# EAGLE design wordclock (EAGLE 5.10)
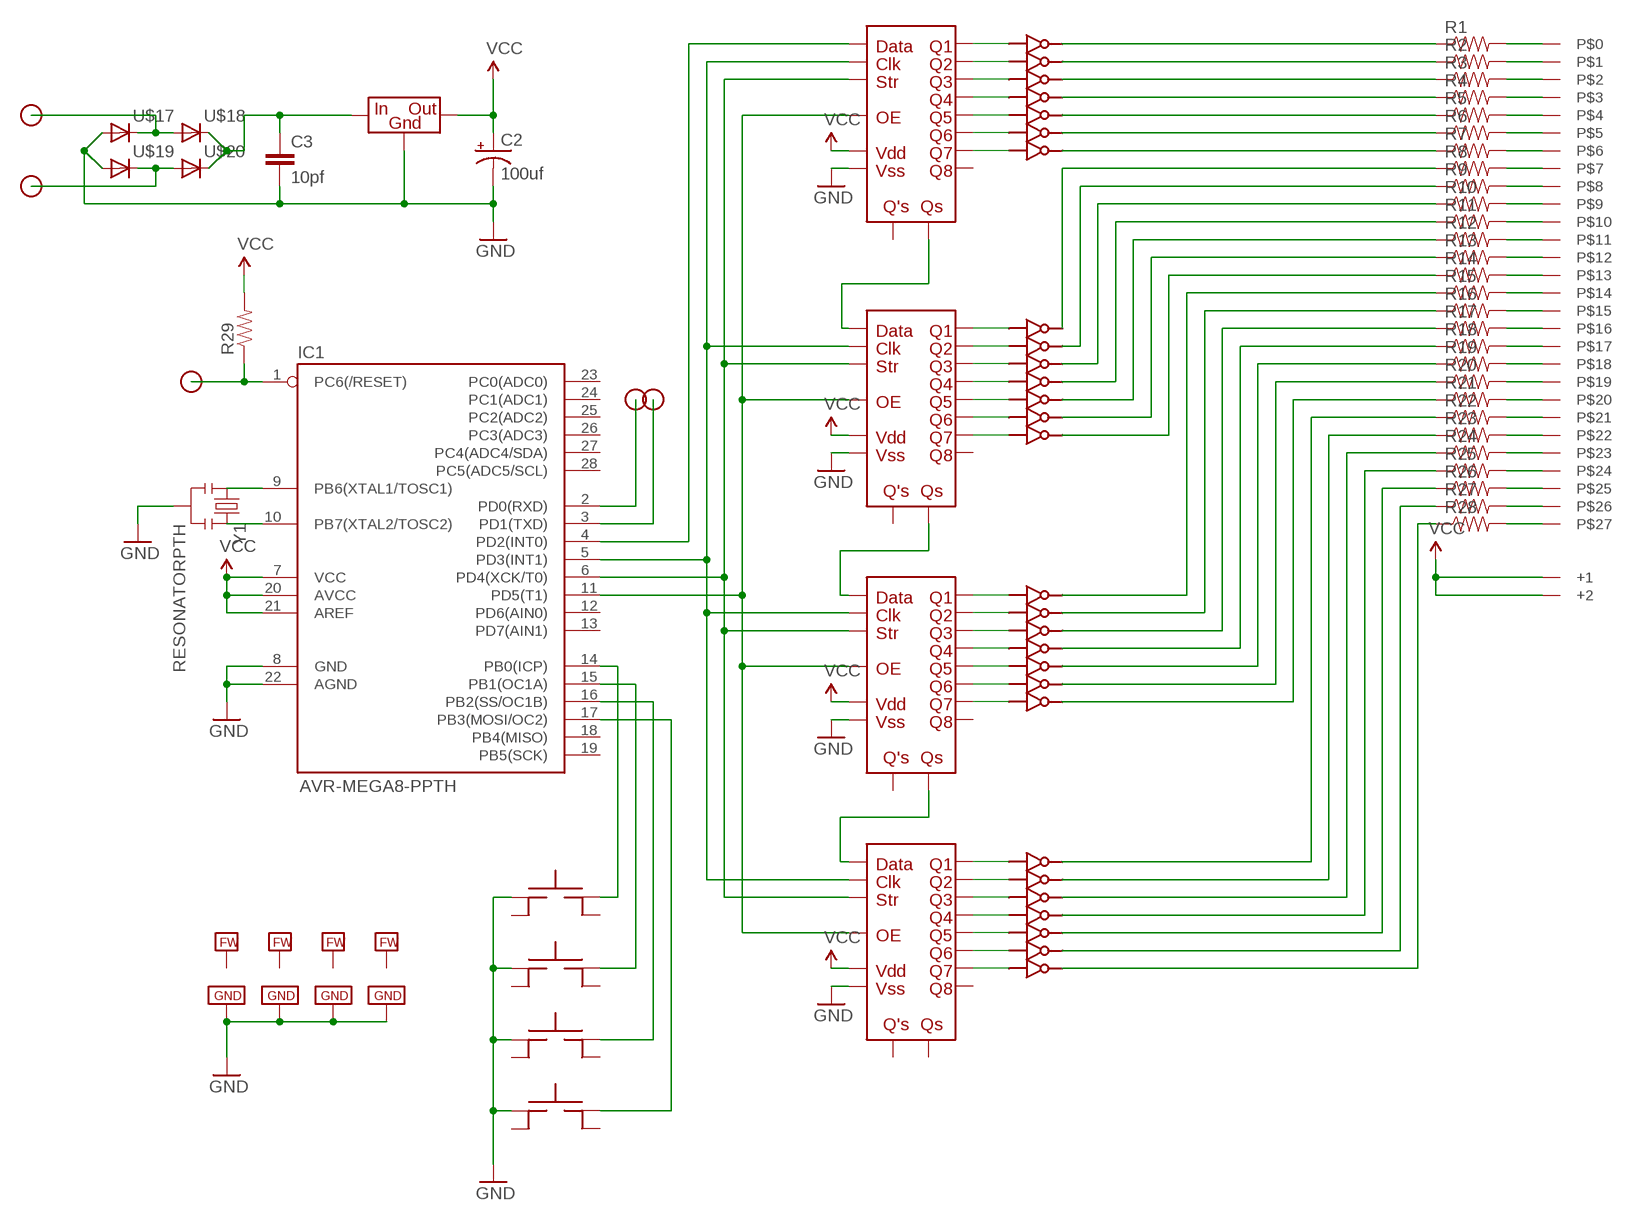
[diagram p0: schematic, sheet 1]

## Parts
C2  100uf  CAP_POLPTH1  [CPOL-RADIAL-100UF-25V]
C3  10pf  CAPPTH2  [CAP-PTH-SMALL2]
DA0  7_DARLINGTON_ARRAY  [16DIP]
DA1  7_DARLINGTON_ARRAY  [16DIP]
DA2  7_DARLINGTON_ARRAY  [16DIP]
DA3  7_DARLINGTON_ARRAY  [16DIP]
HR+  TL3315  [TL3315]
HR-  TL3315  [TL3315]
IC1  AVR-MEGA8-PPTH  [DIL28-3]
MIN+  TL3315  [TL3315]
MIN-  TL3315  [TL3315]
PROG_RST  TERMINAL20GA  [20GA_WIRE_TERM]
PROG_RXD  TERMINAL20GA  [20GA_WIRE_TERM]
PROG_TXD  TERMINAL20GA  [20GA_WIRE_TERM]
R1  RESISTORPTH-1/4W  [AXIAL-0.4]
R2  RESISTORPTH-1/4W  [AXIAL-0.4]
R3  RESISTORPTH-1/4W  [AXIAL-0.4]
R4  RESISTORPTH-1/4W  [AXIAL-0.4]
R5  RESISTORPTH-1/4W  [AXIAL-0.4]
R6  RESISTORPTH-1/4W  [AXIAL-0.4]
R7  RESISTORPTH-1/4W  [AXIAL-0.4]
R8  RESISTORPTH-1/4W  [AXIAL-0.4]
R9  RESISTORPTH-1/4W  [AXIAL-0.4]
R10  RESISTORPTH-1/4W  [AXIAL-0.4]
R11  RESISTORPTH-1/4W  [AXIAL-0.4]
R12  RESISTORPTH-1/4W  [AXIAL-0.4]
R13  RESISTORPTH-1/4W  [AXIAL-0.4]
R14  RESISTORPTH-1/4W  [AXIAL-0.4]
R15  RESISTORPTH-1/4W  [AXIAL-0.4]
R16  RESISTORPTH-1/4W  [AXIAL-0.4]
R17  RESISTORPTH-1/4W  [AXIAL-0.4]
R18  RESISTORPTH-1/4W  [AXIAL-0.4]
R19  RESISTORPTH-1/4W  [AXIAL-0.4]
R20  RESISTORPTH-1/4W  [AXIAL-0.4]
R21  RESISTORPTH-1/4W  [AXIAL-0.4]
R22  RESISTORPTH-1/4W  [AXIAL-0.4]
R23  RESISTORPTH-1/4W  [AXIAL-0.4]
R24  RESISTORPTH-1/4W  [AXIAL-0.4]
R25  RESISTORPTH-1/4W  [AXIAL-0.4]
R26  RESISTORPTH-1/4W  [AXIAL-0.4]
R27  RESISTORPTH-1/4W  [AXIAL-0.4]
R28  RESISTORPTH-1/4W  [AXIAL-0.4]
R29  RESISTORPTH-1/4W  [AXIAL-0.4]
SR0  SREG_HCF4094B  [16DIP]
SR1  SREG_HCF4094B  [16DIP]
SR2  SREG_HCF4094B  [16DIP]
SR3  SREG_HCF4094B  [16DIP]
U$9  VREG_750CT_IN-OUT-GND  [VREG_IN-OUT-GND]
U$10  TERMINAL20GA  [20GA_WIRE_TERM]
U$11  TERMINAL20GA  [20GA_WIRE_TERM]
U$16  WORD_CLOCK_HEADER  [WORD_CLOCK_HEADER]
U$17  DIODE_DO-41  [DO-41]
U$18  DIODE_DO-41  [DO-41]
U$19  DIODE_DO-41  [DO-41]
U$20  DIODE_DO-41  [DO-41]
Y1  RESONATORPTH  [RESONATOR-PTH]

## Nets
CLK: IC1.5(PD3(INT1)) SR0.3(CLK) SR1.3(CLK) SR2.3(CLK) SR3.3(CLK)
DATA0: IC1.4(PD2(INT0)) SR0.2(DATA)
DATA1: SR0.9(QS) SR1.2(DATA)
DATA2: SR1.9(QS) SR2.2(DATA)
DATA3: SR2.9(QS) SR3.2(DATA)
GND: C2.2(-) C3.2 DA0.8(GND) DA1.8(GND) DA2.8(GND) DA3.8(GND) HR+.1 HR-.1 IC1.8(GND) IC1.22(AGND) MIN+.1 MIN-.1 SR0.8(VSS) SR1.8(VSS) SR2.8(VSS) SR3.8(VSS) U$9.GND U$17.1 U$19.1 Y1.2
HR+: HR+.3 IC1.14(PB0(ICP))
HR-: HR-.3 IC1.15(PB1(OC1A))
MIN+: IC1.16(PB2(SS/OC1B)) MIN+.3
MIN-: IC1.17(PB3(MOSI/OC2)) MIN-.3
N$1: IC1.9(PB6(XTAL1/TOSC1)) Y1.1
N$2: IC1.10(PB7(XTAL2/TOSC2)) Y1.3
N$3: IC1.1(PC6(/RESET)) PROG_RST.0 R29.P$1
N$5: DA0.1(IN) SR0.4(Q1)
N$6: DA0.2(IN) SR0.5(Q2)
N$7: DA0.3(IN) SR0.6(Q3)
N$8: DA0.4(IN) SR0.7(Q4)
N$9: DA0.6(IN) SR0.13(Q6)
N$10: DA0.7(IN) SR0.12(Q7)
N$11: DA0.5(IN) SR0.14(Q5)
N$12: DA1.1(IN) SR1.4(Q1)
N$13: DA1.2(IN) SR1.5(Q2)
N$14: DA1.3(IN) SR1.6(Q3)
N$15: DA1.4(IN) SR1.7(Q4)
N$16: DA1.6(IN) SR1.13(Q6)
N$17: DA1.7(IN) SR1.12(Q7)
N$18: DA1.5(IN) SR1.14(Q5)
N$19: DA2.1(IN) SR2.4(Q1)
N$20: DA2.2(IN) SR2.5(Q2)
N$21: DA2.3(IN) SR2.6(Q3)
N$22: DA2.4(IN) SR2.7(Q4)
N$23: DA2.6(IN) SR2.13(Q6)
N$24: DA2.7(IN) SR2.12(Q7)
N$25: DA2.5(IN) SR2.14(Q5)
N$27: DA3.1(IN) SR3.4(Q1)
N$28: DA3.2(IN) SR3.5(Q2)
N$29: DA3.3(IN) SR3.6(Q3)
N$30: DA3.4(IN) SR3.7(Q4)
N$31: DA3.6(IN) SR3.13(Q6)
N$32: DA3.7(IN) SR3.12(Q7)
N$33: DA3.5(IN) SR3.14(Q5)
N$43: DA0.16(OUT) R1.P$1
N$44: DA0.15(OUT) R2.P$1
N$45: DA0.14(OUT) R3.P$1
N$46: DA0.13(OUT) R4.P$1
N$47: DA0.12(OUT) R5.P$1
N$48: DA0.11(OUT) R6.P$1
N$49: DA0.10(OUT) R7.P$1
N$50: DA1.16(OUT) R8.P$1
N$51: DA1.15(OUT) R9.P$1
N$52: DA1.14(OUT) R10.P$1
N$53: DA1.13(OUT) R11.P$1
N$54: DA1.12(OUT) R12.P$1
N$55: DA1.11(OUT) R13.P$1
N$56: DA1.10(OUT) R14.P$1
N$57: DA2.16(OUT) R15.P$1
N$58: DA2.15(OUT) R16.P$1
N$59: DA2.14(OUT) R17.P$1
N$60: DA2.13(OUT) R18.P$1
N$61: DA2.12(OUT) R19.P$1
N$62: DA2.11(OUT) R20.P$1
N$63: DA2.10(OUT) R21.P$1
N$64: DA3.16(OUT) R22.P$1
N$65: DA3.15(OUT) R23.P$1
N$66: DA3.14(OUT) R24.P$1
N$67: DA3.13(OUT) R25.P$1
N$68: DA3.12(OUT) R26.P$1
N$69: DA3.11(OUT) R27.P$1
N$70: DA3.10(OUT) R28.P$1
N$71: R1.P$2 U$16.P$0
N$72: R2.P$2 U$16.P$1
N$73: R3.P$2 U$16.P$2
N$74: R4.P$2 U$16.P$3
N$75: R5.P$2 U$16.P$4
N$76: R6.P$2 U$16.P$5
N$77: R7.P$2 U$16.P$6
N$78: R8.P$2 U$16.P$7
N$79: R9.P$2 U$16.P$8
N$80: R10.P$2 U$16.P$9
N$81: R11.P$2 U$16.P$10
N$82: R12.P$2 U$16.P$11
N$83: R13.P$2 U$16.P$12
N$84: R14.P$2 U$16.P$13
N$85: R15.P$2 U$16.P$14
N$86: R16.P$2 U$16.P$15
N$87: R17.P$2 U$16.P$16
N$88: R18.P$2 U$16.P$17
N$89: R19.P$2 U$16.P$18
N$90: R20.P$2 U$16.P$19
N$91: R21.P$2 U$16.P$20
N$92: R22.P$2 U$16.P$21
N$93: R23.P$2 U$16.P$22
N$94: R24.P$2 U$16.P$23
N$95: R25.P$2 U$16.P$24
N$96: R26.P$2 U$16.P$25
N$97: R27.P$2 U$16.P$26
N$98: R28.P$2 U$16.P$27
N$99: U$11.0 U$19.0 U$20.1
N$100: U$10.0 U$17.0 U$18.1
N$102: C3.1 U$9.IN U$18.0 U$20.0
OE: IC1.11(PD5(T1)) SR0.15(OE) SR1.15(OE) SR2.15(OE) SR3.15(OE)
PROG_RXD: IC1.3(PD1(TXD)) PROG_RXD.0
PROG_TXD: IC1.2(PD0(RXD)) PROG_TXD.0
STR: IC1.6(PD4(XCK/T0)) SR0.1(STR) SR1.1(STR) SR2.1(STR) SR3.1(STR)
VCC: C2.1(+) IC1.7(VCC) IC1.20(AVCC) IC1.21(AREF) R29.P$2 SR0.16(VDD) SR1.16(VDD) SR2.16(VDD) SR3.16(VDD) U$9.OUT U$16.+1 U$16.+2
Unconnected: DA0.9(FW) DA1.9(FW) DA2.9(FW) DA3.9(FW) HR+.2 HR+.4 HR-.2 HR-.4 IC1.12(PD6(AIN0)) IC1.13(PD7(AIN1)) IC1.18(PB4(MISO)) IC1.19(PB5(SCK)) IC1.23(PC0(ADC0)) IC1.24(PC1(ADC1)) IC1.25(PC2(ADC2)) IC1.26(PC3(ADC3)) IC1.27(PC4(ADC4/SDA)) IC1.28(PC5(ADC5/SCL)) MIN+.2 MIN+.4 MIN-.2 MIN-.4 SR0.10(Q'S) SR0.11(Q8) SR1.10(Q'S) SR1.11(Q8) SR2.10(Q'S) SR2.11(Q8) SR3.9(QS) SR3.10(Q'S) SR3.11(Q8)

## Library data of the parts
C2 = SparkFun:CAP_POL: Capacitor Polarized These are standard SMD and PTH capacitors. Normally 10uF, 47uF, and 100uF in electrolytic and tantalum varieties. Always verify the external diameter of the through hole cap, it varies with capacity, voltage, and manufacturer. The EIA devices should be standard.
C3 = SparkFun:CAP: Capacitor Standard 0603 ceramic capacitor, and 0.1" leaded capacitor.
DA0 DA1-DA3 = walthour:7_DARLINGTON_ARRAY
HR+ HR- MIN+ MIN- = walthour:TL3315
IC1 = SparkFun:AVR-MEGA8-P: MICROCONTROLLER 8 Kbytes FLASH 1 kbytes SRAM 512 bytes EEPROM USART 4-channel 10 bit ADC 2-channel 8 bit ADC
PROG_RST PROG_RXD PROG_TXD U$10 U$11 = walthour:TERMINAL: A simple terminal hole to solder a wire into.
R1-R29 = SparkFun:RESISTOR: Resistor Basic schematic elements and footprints for 0603, 1206, and PTH resistors.
SR0 SR1-SR3 = walthour:SREG_HCF4094B: 8-bit shift register with output enable and strobe.
U$9 = walthour:VREG_750CT_IN-OUT-GND
U$16 = walthour:WORD_CLOCK_HEADER
U$17-U$20 = walthour:DIODE: A DO-41 packaged diode
Y1 = SparkFun:RESONATOR: Resonator Small SMD resonator. This is the itty bitty 10/20MHz resonators with built in caps. CSTCE10M0G55 and CSTCE20M0V53. Footprint has been reviewed closely but hasn't been tested yet.

## Board
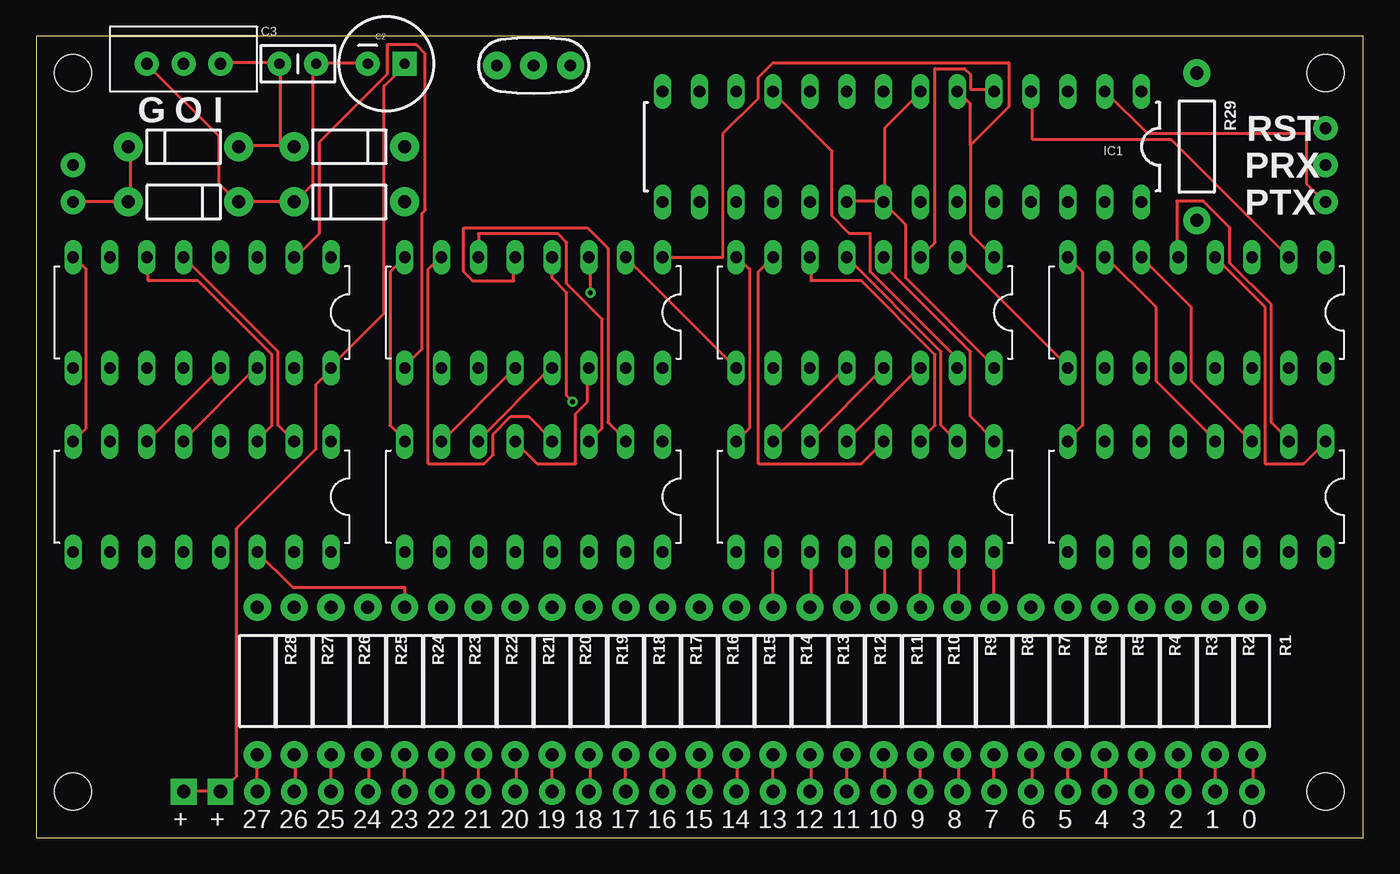
[diagram p1: board, top side]
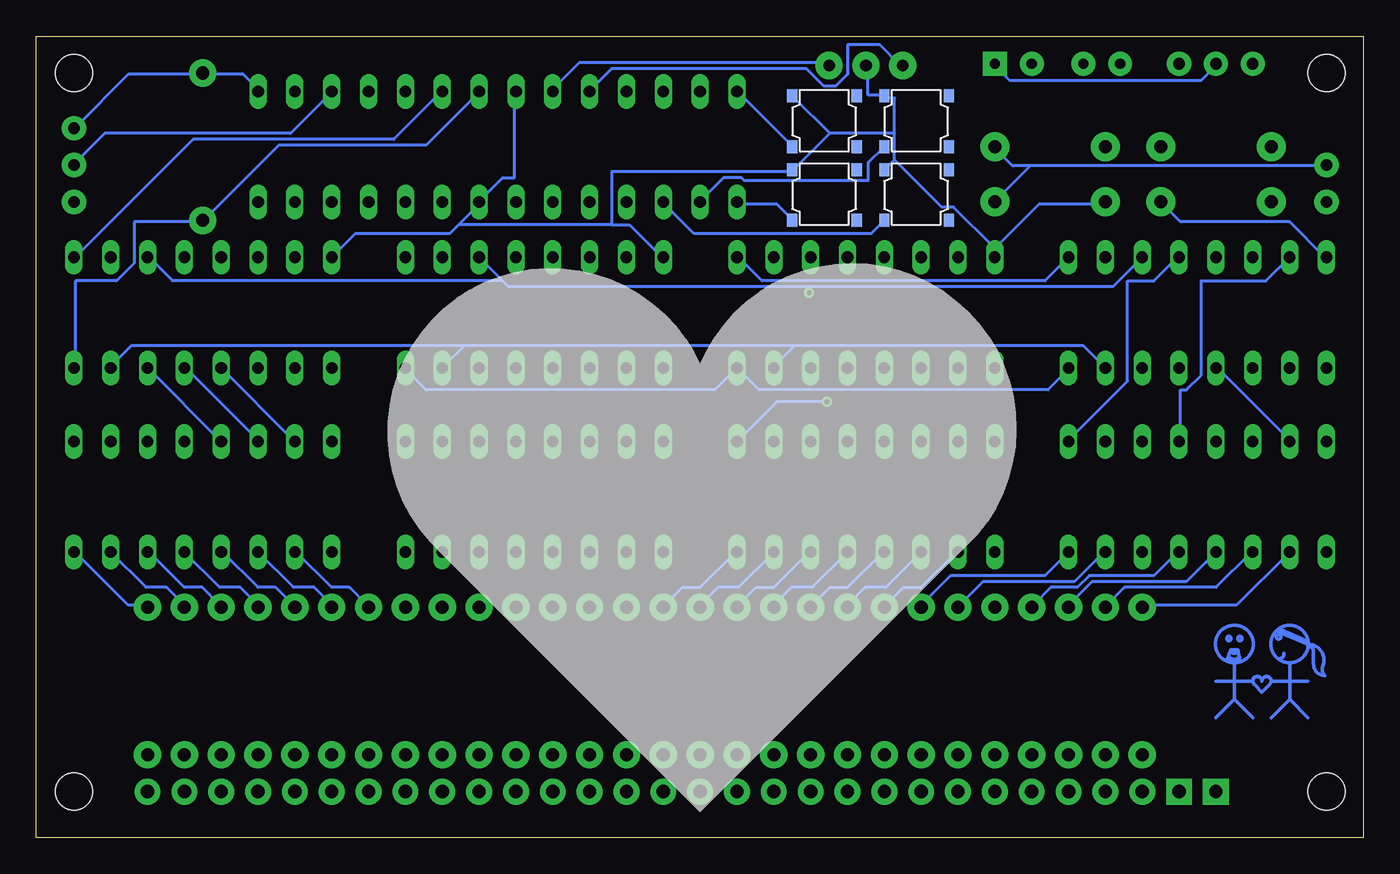
[diagram p2: board, bottom side, seen from below]

Size 91.49 x 55.23 mm. Coordinates in mm from the lower left corner, seen from the top.
Outline: 0,0 91.49,0 91.49,55.23 0,55.23 0,0
Copper layers (1*16): Top 0.0356mm / dielectric 1.5011mm / Bottom 0.0356mm
Design rules "LaenPCBOrder *": minimum track width 8mil, minimum drill 13mil, track to track 8mil, track to pad 8mil, pad to pad 8mil, via to via 8mil, smd to smd 8mil, copper to edge 15mil, drill to drill 8mil, minimum pad ring 7mil, minimum via ring 7mil, stop-mask expansion 4mil, vias tented up to drill 0mil, thermal gap 10mil
Holes 2.54 mm at 88.9,52.71 2.54,52.71 2.54,3.17 88.9,3.17

### Footprints (pad centres in the part's own frame; a part is rotated, then mirrored left to right if it is on the bottom)
CPOL-RADIAL-100UF-25V = drill 0.7 pad 1.651 square: 1 1.27,0 | drill 0.7 pad 1.651 round: 2 -1.27,0
CAP-PTH-SMALL2 = drill 0.7 pad 1.651 round: 1 0,0; 2 2.54,0
16DIP = drill 0.8 long: 1 -8.89,-3.81; 2 -6.35,-3.81; 3 -3.81,-3.81; 4 -1.27,-3.81; 5 1.27,-3.81; 6 3.81,-3.81; 7 6.35,-3.81; 8 8.89,-3.81; 9 8.89,3.81; 10 6.35,3.81; 11 3.81,3.81; 12 1.27,3.81; 13 -1.27,3.81; 14 -3.81,3.81; 15 -6.35,3.81; 16 -8.89,3.81
TL3315 = smd 0.7 x 0.9: 1 0,3.5; 2 4.45,3.5; 3 0,0; 4 4.45,0
DIL28-3 = drill 0.813 long: 1 -16.51,-3.81; 2 -13.97,-3.81; 3 -11.43,-3.81; 4 -8.89,-3.81; 5 -6.35,-3.81; 6 -3.81,-3.81; 7 -1.27,-3.81; 8 1.27,-3.81; 9 3.81,-3.81; 10 6.35,-3.81; 11 8.89,-3.81; 12 11.43,-3.81; 13 13.97,-3.81; 14 16.51,-3.81; 15 16.51,3.81; 16 13.97,3.81; 17 11.43,3.81; 18 8.89,3.81; 19 6.35,3.81; 20 3.81,3.81; 21 1.27,3.81; 22 -1.27,3.81; 23 -3.81,3.81; 24 -6.35,3.81; 25 -8.89,3.81; 26 -11.43,3.81; 27 -13.97,3.81; 28 -16.51,3.81
20GA_WIRE_TERM = drill 0.8 pad 1.676 round: 0 0,0
AXIAL-0.4 = drill 0.9 pad 1.88 round: P$1 -5.08,0; P$2 5.08,0
VREG_IN-OUT-GND = drill 0.8 pad 1.676 round: GND 2.54,0; IN -2.54,0; OUT 0,0
WORD_CLOCK_HEADER = drill 0.914 pad 1.778 square: +1 68.58,0; +2 71.12,0 | drill 0.914 pad 1.778 round: P$0 -2.54,0; P$1 0,0; P$2 2.54,0; P$3 5.08,0; P$4 7.62,0; P$5 10.16,0; P$6 12.7,0; P$7 15.24,0; P$8 17.78,0; P$9 20.32,0; P$10 22.86,0; P$11 25.4,0; P$12 27.94,0; P$13 30.48,0; P$14 33.02,0; P$15 35.56,0; P$16 38.1,0; P$17 40.64,0; P$18 43.18,0; P$19 45.72,0; P$20 48.26,0; P$21 50.8,0; P$22 53.34,0; P$23 55.88,0; P$24 58.42,0; P$25 60.96,0; P$26 63.5,0; P$27 66.04,0
DO-41 = drill 0.9 pad 2 round: 0 -3.81,0; 1 3.81,0
RESONATOR-PTH = drill 0.8 pad 1.88 round: 1 -2.54,0; 2 0,0; 3 2.54,0

### Placement (x,y rotation side)
C2  24.13,53.34 0 top
C3  16.76,53.34 0 top
DA0  80.01,23.49 180 top
DA1  57.15,23.49 180 top
DA2  34.29,23.49 180 top
DA3  11.43,23.49 180 top
HR+  39.37,47.62 0 bottom
HR-  39.37,42.55 0 bottom
IC1  59.69,47.62 180 top
MIN+  33.02,47.62 0 bottom
MIN-  33.02,42.55 0 bottom
PROG_RST  88.9,48.9 0 top
PROG_RXD  88.9,46.36 0 top
PROG_TXD  88.9,43.82 0 top
R1  83.82,10.79 270 top
R2  81.28,10.79 270 top
R3  78.74,10.79 270 top
R4  76.2,10.79 270 top
R5  73.66,10.79 270 top
R6  71.12,10.79 270 top
R7  68.58,10.79 270 top
R8  66.04,10.79 270 top
R9  63.5,10.79 270 top
R10  60.96,10.79 270 top
R11  58.42,10.79 270 top
R12  55.88,10.79 270 top
R13  53.34,10.79 270 top
R14  50.8,10.79 270 top
R15  48.26,10.79 270 top
R16  45.72,10.79 270 top
R17  43.18,10.79 270 top
R18  40.64,10.79 270 top
R19  38.1,10.79 270 top
R20  35.56,10.79 270 top
R21  33.02,10.79 270 top
R22  30.48,10.79 270 top
R23  27.94,10.79 270 top
R24  25.4,10.79 270 top
R25  22.86,10.79 270 top
R26  20.32,10.79 270 top
R27  17.78,10.79 270 top
R28  15.24,10.79 270 top
R29  80.01,47.62 270 top
SR0  80.01,36.2 180 top
SR1  57.15,36.2 180 top
SR2  34.29,36.2 180 top
SR3  11.43,36.2 180 top
U$1  [JW_COPPER]  8.89,10.79 0 top
U$2  [EW_COPPER]  5.08,10.79 0 top
U$9  10.16,53.34 180 top
U$10  2.54,43.82 0 top
U$11  2.54,46.36 0 top
U$16  81.28,3.17 180 top
U$17  10.16,43.82 0 top
U$18  10.16,47.62 180 top
U$19  21.59,43.82 180 top
U$20  21.59,47.62 0 top
Y1  34.29,53.21 180 top

### Tracks (layer width: path | path; a pad name or v marks a point on that pad's centre or on a via)
CLK  (via drill 0.33)
  Top 0.203: v38.2,37.57 38.2,40.01 SR2.3 | SR1.3 61.98,41.02 61.98,53.01 64.01,53.01 64.41,52.6 64.41,51.59 66.04,51.59 IC1.5
  Bottom 0.203: SR3.3 17.27,37.97 38.2,37.97 | 38.2,37.97 58.93,37.97 59.33,38.38 | 59.33,38.38 SR1.3 | 38.2,37.97 v38.2,37.57 | 59.33,38.38 82.09,38.38 83.72,40.01 SR0.3
DATA0
  Top 0.203: SR0.2 78.23,48.13 68.68,48.13 68.68,51.38 IC1.4
DATA1
  Top 0.203: SR1.2 63.6,40.01 71.12,32.49 SR0.9
DATA2
  Top 0.203: SR2.2 SR1.9
DATA3
  Top 0.203: SR2.9 25.4,32.49 26.62,33.71 26.62,43.05 26.82,43.26 26.82,54.03 26.21,54.64 24.18,54.64 24.18,52.6 19.51,47.93 19.51,41.63 17.88,40.01 SR3.2
GND
  Top 0.203: DA1.8 49.17,28.22 49.17,39.19 48.36,40.01 SR1.8 | SR0.8 72.14,38.99 72.14,28.42 71.12,27.41 DA0.8 | SR2.8 24.38,38.99 24.38,28.42 25.4,27.41 DA2.8 | DA3.8 3.45,28.22 3.45,39.19 2.64,40.01 SR3.8 | C2.2 22.76,53.42 19.3,53.42 C3.2 19.3,53.21 19.1,53.01 19.1,45.09 17.88,43.87 U$19.1 17.68,43.87 14.02,43.87 U$17.1 13.82,43.87 12.6,45.09 12.6,48.34 7.72,53.21 U$9.GND
  Bottom 0.203: IC1.8 58.52,51.38 58.52,45.49 59.33,45.49 60.96,43.87 IC1.22 60.96,43.66 62.38,42.24 | 62.38,42.24 62.99,41.63 69.49,41.63 SR0.8 | 51.82,42.24 62.38,42.24 | 51.82,42.24 50.6,42.24 48.36,40.01 SR1.8 | 32.31,46.71 32.92,46.1 MIN-.1 | 32.31,48.54 32.31,50.98 32.92,50.98 MIN+.1 33.12,51.18 34.14,51.18 34.14,53.21 Y1.2 | 32.31,46.71 32.31,48.54 | 36.78,48.54 39.22,46.1 HR-.1 39.42,45.9 51.82,45.9 51.82,42.24 | 32.31,48.54 36.78,48.54 | 36.78,48.54 39.22,50.98 HR+.1 | 32.31,46.71 29.06,43.46 28.25,43.46 25.4,40.62 | SR3.8 2.64,40.01 5.08,42.44 12.6,42.44 U$17.1 | 25.4,40.62 22.35,43.66 17.88,43.66 U$19.1 | 25.4,40.62 SR2.8
HR+
  Bottom 0.203: HR+.3 39.42,47.73 43.08,51.38 IC1.14
HR-
  Bottom 0.203: HR-.3 39.42,42.65 40.44,43.66 43.08,43.66 IC1.15
MIN+
  Bottom 0.203: MIN+.3 34.14,46.51 34.14,45.29 42.67,45.29 42.88,45.49 44.09,45.49 45.72,43.87 IC1.16
MIN-
  Bottom 0.203: MIN-.3 33.93,41.63 46.13,41.63 48.16,43.66 IC1.17
N$1
  Bottom 0.203: IC1.9 55.88,51.59 54.05,53.42 37.19,53.42 36.98,53.21 Y1.1
N$2
  Bottom 0.203: IC1.10 53.24,51.59 51.82,53.01 38.41,53.01 37.19,51.79 36.37,51.79 35.56,52.6 35.56,54.64 33.33,54.64 31.9,53.21 Y1.3
N$3
  Bottom 0.203: IC1.1 76.2,51.59 77.22,52.6 79.86,52.6 R29.P$1 80.06,52.6 85.14,52.6 88.8,48.95 PROG_RST.0
N$5
  Top 0.203: SR0.4 84.73,36.55 84.73,25.78 87.38,25.78 DA0.1
N$6
  Top 0.203: DA0.2 86.36,27.41 85.14,28.63 85.14,36.75 82.3,39.6 82.3,42.04 80.47,43.87 78.64,43.87 78.64,40.01 SR0.5
N$7
  Top 0.203: SR0.6 79.65,36.55 79.65,31.47 DA0.3
N$8
  Top 0.203: DA0.4 81.28,27.41 77.22,31.47 77.22,36.55 73.76,40.01 SR0.7
N$9
  Bottom 0.203: DA0.6 76.2,27.41 81.08,32.28 81.28,32.28 SR0.13
N$10
  Bottom 0.203: DA0.7 SR0.12
N$11
  Bottom 0.203: DA0.5 SR0.14
N$12
  Top 0.203: DA1.1 66.04,27.41 64.41,29.03 64.41,33.5 58.52,39.4 58.52,40.01 SR1.4
N$13
  Top 0.203: SR1.5 62.38,33.5 62.38,28.42 DA1.2
N$14
  Top 0.203: DA1.3 60.96,27.41 61.98,28.42 61.98,33.3 56.9,38.38 53.44,38.38 53.44,40.01 SR1.6
N$15
  Top 0.203: SR1.7 49.78,38.99 49.78,25.78 56.9,25.78 DA1.4
N$16
  Top 0.203: DA1.6 SR1.13
N$17
  Top 0.203: DA1.7 50.8,27.41 55.88,32.49 SR1.12
N$18
  Top 0.203: DA1.5 55.88,27.41 60.96,32.49 SR1.14
N$19  (via drill 0.33)
  Top 0.203: v36.98,30.05 36.58,30.45 36.58,37.57 35.56,38.58 SR2.4
  Bottom 0.203: v36.98,30.05 40.44,30.05 DA2.1
N$20
  Top 0.203: DA2.2 40.64,27.41 39.42,28.63 39.42,40.62 38,42.04 29.46,42.04 29.46,38.99 30.07,38.38 32.92,38.38 32.92,40.01 SR2.5
N$21
  Top 0.203: SR2.6 30.48,41.63 35.97,41.63 36.58,41.02 36.58,38.18 39.01,35.74 39.01,28.22 DA2.3
N$22
  Top 0.203: DA2.4 35.56,27.41 33.93,29.03 32.72,29.03 31.5,27.81 31.5,26.39 30.89,25.78 27.03,25.78 27.03,39.19 27.84,40.01 SR2.7
N$23
  Top 0.203: DA2.6 30.48,27.41 35.56,32.49 SR2.13
N$24
  Top 0.203: DA2.7 SR2.12
N$25
  Top 0.203: DA2.5 34.54,25.78 37.19,25.78 37.19,29.23 38,30.05 38,32.28 SR2.14
N$27
  Bottom 0.203: DA3.1 20.32,27.41 16.26,31.47 16.26,38.38 14.43,38.38 12.8,40.01 SR3.4
N$28
  Top 0.203: SR3.5 16.66,33.5 16.66,28.42 DA3.2
N$29
  Top 0.203: DA3.3 15.24,27.41 16.26,28.42 16.26,33.3 11.18,38.38 7.72,38.38 7.72,40.01 SR3.6
N$30
  Bottom 0.203: SR3.7 6.71,38.38 11.18,38.38 11.18,31.88 12.19,30.86 12.6,30.86 12.6,27.41 DA3.4
N$31
  Top 0.203: DA3.6 SR3.13
N$32
  Bottom 0.203: DA3.7 5.08,27.41 9.96,32.28 10.16,32.28 SR3.12
N$33
  Top 0.203: DA3.5 10.16,27.41 15.24,32.49 SR3.14
N$43
  Bottom 0.203: DA0.16 88.8,19.68 85.14,16.03 83.92,16.03 R1.P$1
N$44
  Bottom 0.203: DA0.15 83.92,17.25 82.5,17.25 81.28,16.03 R2.P$1
N$45
  Bottom 0.203: DA0.14 83.72,19.68 81.28,17.25 80.06,17.25 78.84,16.03 R3.P$1
N$46
  Bottom 0.203: DA0.13 78.84,17.25 77.42,17.25 76.2,16.03 R4.P$1
N$47
  Bottom 0.203: DA0.12 78.64,19.68 76.2,17.25 74.98,17.25 73.76,16.03 R5.P$1
N$48
  Bottom 0.203: DA0.11 73.76,17.25 72.34,17.25 71.12,16.03 R6.P$1
N$49
  Bottom 0.203: DA0.10 73.56,19.68 71.12,17.25 69.9,17.25 68.68,16.03 R7.P$1
N$50
  Top 0.203: R8.P$1 DA1.16
N$51
  Top 0.203: DA1.15 63.6,19.68 63.6,16.03 R9.P$1
N$52
  Top 0.203: R10.P$1 DA1.14
N$53
  Top 0.203: DA1.13 58.52,19.68 58.52,16.03 R11.P$1
N$54
  Top 0.203: R12.P$1 DA1.12
N$55
  Top 0.203: DA1.11 53.44,19.68 53.44,16.03 R13.P$1
N$56
  Top 0.203: R14.P$1 DA1.10
N$57
  Bottom 0.203: DA2.16 43.28,19.68 45.72,17.25 46.94,17.25 48.16,16.03 R15.P$1
N$58
  Bottom 0.203: DA2.15 43.08,17.25 44.5,17.25 45.72,16.03 R16.P$1
N$59
  Bottom 0.203: DA2.14 38.2,19.68 40.64,17.25 41.86,17.25 43.08,16.03 R17.P$1
N$60
  Bottom 0.203: DA2.13 38,17.25 39.42,17.25 40.64,16.03 R18.P$1
N$61
  Bottom 0.203: DA2.12 33.12,19.68 35.56,17.25 36.78,17.25 38,16.03 R19.P$1
N$62
  Bottom 0.203: DA2.11 32.92,17.25 34.34,17.25 35.56,16.03 R20.P$1
N$63
  Bottom 0.203: DA2.10 28.04,19.68 30.48,17.25 31.7,17.25 32.92,16.03 R21.P$1
N$64
  Bottom 0.203: DA3.16 21.95,18.06 28.45,18.06 30.48,16.03 R22.P$1
N$65
  Bottom 0.203: DA3.15 17.88,19.68 19.91,17.65 26.21,17.65 27.84,16.03 R23.P$1
N$66
  Top 0.203: DA3.14 17.68,17.25 25.4,17.25 R24.P$1
N$67
  Bottom 0.203: DA3.13 12.8,19.68 14.43,18.06 18.9,18.06 19.71,17.25 21.54,17.25 22.76,16.03 R25.P$1
N$68
  Bottom 0.203: DA3.12 12.19,17.65 18.69,17.65 20.32,16.03 R26.P$1
N$69
  Bottom 0.203: DA3.11 7.72,19.68 10.16,17.25 16.46,17.25 17.68,16.03 R27.P$1
N$70
  Bottom 0.203: DA3.10 8.74,16.03 15.24,16.03 R28.P$1
N$71
  Top 0.203: U$16.P$0 83.92,3.23 83.92,5.66 R1.P$2
N$72
  Top 0.203: U$16.P$1 R2.P$2
N$73
  Top 0.203: U$16.P$2 78.84,3.23 78.84,5.66 R3.P$2
N$74
  Top 0.203: U$16.P$3 R4.P$2
N$75
  Top 0.203: U$16.P$4 73.76,3.23 73.76,5.66 R5.P$2
N$76
  Top 0.203: U$16.P$5 R6.P$2
N$77
  Top 0.203: U$16.P$6 68.68,3.23 68.68,5.66 R7.P$2
N$78
  Top 0.203: U$16.P$7 R8.P$2
N$79
  Top 0.203: U$16.P$8 63.6,3.23 63.6,5.66 R9.P$2
N$80
  Top 0.203: U$16.P$9 R10.P$2
N$81
  Top 0.203: U$16.P$10 58.52,3.23 58.52,5.66 R11.P$2
N$82
  Top 0.203: U$16.P$11 R12.P$2
N$83
  Top 0.203: U$16.P$12 53.44,3.23 53.44,5.66 R13.P$2
N$84
  Top 0.203: U$16.P$13 R14.P$2
N$85
  Top 0.203: U$16.P$14 48.36,3.23 48.36,5.66 R15.P$2
N$86
  Top 0.203: U$16.P$15 R16.P$2
N$87
  Top 0.203: U$16.P$16 43.28,3.23 43.28,5.66 R17.P$2
N$88
  Top 0.203: U$16.P$17 R18.P$2
N$89
  Top 0.203: U$16.P$18 38.2,3.23 38.2,5.66 R19.P$2
N$90
  Top 0.203: U$16.P$19 R20.P$2
N$91
  Top 0.203: U$16.P$20 33.12,3.23 33.12,5.66 R21.P$2
N$92
  Top 0.203: U$16.P$21 R22.P$2
N$93
  Top 0.203: U$16.P$22 28.04,3.23 28.04,5.66 R23.P$2
N$94
  Top 0.203: U$16.P$23 R24.P$2
N$95
  Top 0.203: U$16.P$24 22.96,3.23 22.96,5.66 R25.P$2
N$96
  Top 0.203: U$16.P$25 R26.P$2
N$97
  Top 0.203: U$16.P$26 17.88,3.23 17.88,5.66 R27.P$2
N$98
  Top 0.203: U$16.P$27 R28.P$2
N$99
  Bottom 0.203: 22.96,46.3 24.18,46.3 25.4,47.52 U$20.1 | 22.96,46.3 2.64,46.3 U$11.0 | 22.96,46.3 25.4,43.87 U$19.0
N$100
  Top 0.203: U$10.0 2.64,43.87 6.3,43.87 U$17.0 6.5,43.87 6.5,47.52 U$18.1
N$102
  Top 0.203: U$9.IN 12.8,53.42 16.66,53.42 C3.1 16.87,53.21 16.87,47.73 | 16.87,47.73 17.68,47.73 U$20.0 16.87,47.73 | 16.87,47.73 14.02,47.73 U$18.0
OE
  Top 0.203: IC1.11 50.8,51.38 54.86,47.32 54.86,42.85 56.08,41.63 57.51,41.63 57.51,38.99 63.4,33.1 63.4,32.49 SR1.15
  Bottom 0.203: 39.22,33.91 19.3,33.91 SR3.15 | 39.22,33.91 40.64,32.49 SR2.15 | 39.22,33.91 61.98,33.91 | 61.98,33.91 SR1.15 | 61.98,33.91 84.94,33.91 86.36,32.49 SR0.15
PROG_RXD
  Bottom 0.203: IC1.3 71.12,51.38 73.97,48.54 86.77,48.54 88.8,46.51 PROG_RXD.0
PROG_TXD
  Top 0.203: IC1.2 73.76,51.38 76.61,48.54 87.58,48.54 87.58,45.09 88.8,43.87 PROG_TXD.0
STR
  Top 0.203: SR1.1 64.41,41.63 64.41,47.73 | 64.41,47.73 64.41,50.57 63.6,51.38 IC1.6 | 64.41,47.73 67.06,50.37 67.06,53.42 50.8,53.42 49.78,52.4 49.78,50.98 47.35,48.54 47.35,40.01 SR2.1
  Bottom 0.203: SR3.1 21.95,38.38 41.45,38.38 43.08,40.01 SR2.1 | SR0.1 88.8,40.01 80.67,48.13 66.85,48.13 63.6,51.38 IC1.6
VCC
  Top 0.203: IC1.20 55.88,43.87 58.32,43.87 IC1.21 | IC1.7 60.96,51.38 58.52,48.95 58.52,43.87 IC1.21 | IC1.21 58.52,43.66 59.94,42.24 59.94,38.58 66.04,32.49 SR1.16 | U$16.+2 10.16,3.23 12.6,3.23 U$16.+1 12.8,3.23 13.82,4.24 13.82,21.31 19.3,26.8 19.3,31.27 20.32,32.28 SR3.16 20.32,32.49 23.98,36.14 23.98,51.79 25.4,53.21 C2.1
  Bottom 0.203: SR0.16 88.8,32.49 88.8,38.38 85.95,38.38 84.73,39.6 84.73,42.44 80.06,42.44 R29.P$2 79.86,42.65 74.78,47.73 64.62,47.73 60.96,51.38 IC1.7 | SR1.16 66.04,32.28 64.62,30.86 44.7,30.86 SR2.16 41.66,30.86 21.74,30.86 20.32,32.28 SR3.16 | U$9.OUT 10.16,53.21 11.18,52.2 24.38,52.2 25.4,53.21 C2.1

### Text on the board
tPlace: G | O | I | RST | PRX | PTX